# Altium schematic sheet ATMEGA-BOARD.SchDoc
size A4; SheetNumber: 1; SheetTotal: 1
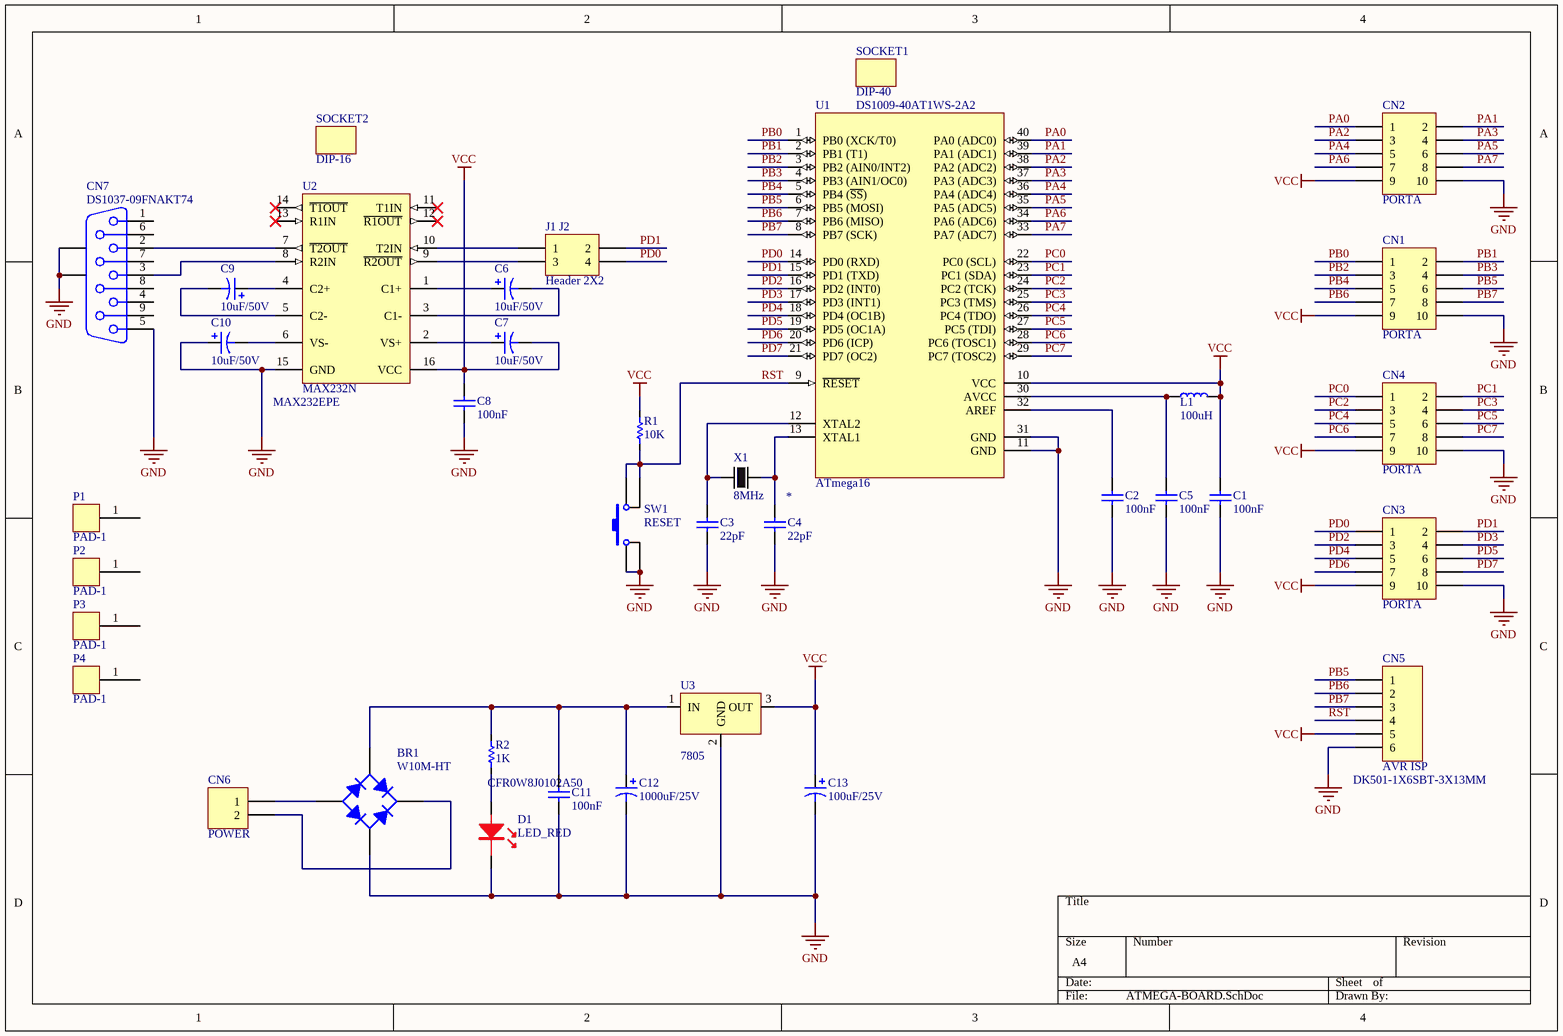
[diagram p0: ATMEGA-BOARD.SchDoc]

## Parts
BR1  W10M-HT  [DIODE-WOB]
C1  100nF  [CAP0.2N]
C2  100nF  [CAP0.2N]
C3  22pF  [CAP0.2N]
C4  22pF  [CAP0.2N]
C5  100nF  [CAP0.2N]
C6  10uF/50V  [CAP_ALUM_5x11x2.5_V]
C7  10uF/50V  [CAP_ALUM_5x11x2.5_V]
C8  100nF  [CAP0.2N]
C9  10uF/50V  [CAP_ALUM_5x11x2.5_V]
C10  10uF/50V  [CAP_ALUM_5x11x2.5_V]
C11  100nF  [CAP0.2N]
C12  1000uF/25V  [CAP_ALUM_10x17x5_V]
C13  100uF/25V  [CAP_ALUM_6.3x11.2x2.5_V]
CN1  PORTA  [CON-DS1013-10SSIB1]
CN2  PORTA  [CON-DS1013-10SSIB1]
CN3  PORTA  [CON-DS1013-10SSIB1]
CN4  PORTA  [CON-DS1013-10SSIB1]
CN5  AVR ISP  Ozdisan Kodu: DK501-1X6SBT-3X13MM  [Pin Header S/M 06x1 TH Pitch 2.54mm]
CN6  POWER  [Klemens-DG126-5.0-02P-14-00AH]
CN7  DS1037-09FNAKT74  [CON-DB9FLW]
D1  LED_RED  [LED3M-RED]
J1_J2  Header 2X2  [Pin Header S/M 02x2 TH Pitch 2.54mm]
L1  100uH  [IND-AL0412]
P1  PAD-1  [DOUBLE-3]  (no BOM)
P2  PAD-1  [DOUBLE-3]  (no BOM)
P3  PAD-1  [DOUBLE-3]  (no BOM)
P4  PAD-1  [DOUBLE-3]  (no BOM)
R1  10K  [RES_AXIAL-0.3]
R2  1K  Ozdisan Kodu: CFR0W8J0102A50  [RES_AXIAL-0.3]
SOCKET1  DIP-40  Ozdisan Kodu: DS1009-40AT1WS-2A2  (mechanical)
SOCKET2  DIP-16  (mechanical)
SW1  RESET  [Switch-6x6x4.3]
U1  ATmega16  [DIP40N]
U2  MAX232N  Ozdisan Kodu: MAX232EPE  [DIP16N]
U3  7805  [TO-220_3-H]
X1  8MHz  [XTAL_DIP]

## Nets
GND: BR1.2(C) C1.1 C2.1 C3.1 C4.1 C5.1 C8.1 C10.1 C11.1 C12.2 C13.2 CN1.10 CN2.10 CN3.10 CN4.10 CN5.6 CN7.5 CN7.BO1(MH2) CN7.BO2(MH1) D1.2(K) SW1.1 U1.11(GND) U1.31(GND) U2.15(GND) U3.2(GND)
VCC: C1.2 C7.2 C8.2 C13.1 CN1.9 CN2.9 CN3.9 CN4.9 CN5.5 L1.2 R1.2 U1.10(VCC) U2.16(VCC) U3.3(OUT)
PA0: CN2.1 U1.40(PA0_(ADC0))
PA1: CN2.2 U1.39(PA1_(ADC1))
PA2: CN2.3 U1.38(PA2_(ADC2))
PA3: CN2.4 U1.37(PA3_(ADC3))
PA4: CN2.5 U1.36(PA4_(ADC4))
PA5: CN2.6 U1.35(PA5_(ADC5))
PA6: CN2.7 U1.34(PA6_(ADC6))
PA7: CN2.8 U1.33(PA7_(ADC7))
PB0: CN1.1 U1.1(PB0_(XCK/T0))
PB1: CN1.2 U1.2(PB1_(T1))
PB2: CN1.3 U1.3(PB2_(AIN0/INT2))
PB3: CN1.4 U1.4(PB3_(AIN1/OC0))
PB4: CN1.5 U1.5(PB4_(~{SS}))
PB5: CN1.6 CN5.1 U1.6(PB5_(MOSI))
PB6: CN1.7 CN5.2 U1.7(PB6_(MISO))
PB7: CN1.8 CN5.3 U1.8(PB7_(SCK))
PC0: CN4.1 U1.22(PC0_(SCL))
PC1: CN4.2 U1.23(PC1_(SDA))
PC2: CN4.3 U1.24(PC2_(TCK))
PC3: CN4.4 U1.25(PC3_(TMS))
PC4: CN4.5 U1.26(PC4_(TDO))
PC5: CN4.6 U1.27(PC5_(TDI))
PC6: CN4.7 U1.28(PC6_(TOSC1))
PC7: CN4.8 U1.29(PC7_(TOSC2))
PD0: CN3.1 J1_J2.4 U1.14(PD0_(RXD))
PD1: CN3.2 J1_J2.2 U1.15(PD1_(TXD))
PD2: CN3.3 U1.16(PD2_(INT0))
PD3: CN3.4 U1.17(PD3_(INT1))
PD4: CN3.5 U1.18(PD4_(OC1B))
PD5: CN3.6 U1.19(PD5_(OC1A))
PD6: CN3.7 U1.20(PD6_(ICP))
PD7: CN3.8 U1.21(PD7_(OC2))
RST: CN5.4 R1.1 SW1.2 U1.9(~{RESET})
NetBR1_1: BR1.1(K) CN6.2
NetBR1_3: BR1.3(A) CN6.1
NetBR1_4: BR1.4(C) C11.2 C12.1 R2.2 U3.1(IN)
NetC2_2: C2.2 U1.32(AREF)
NetC3_2: C3.2 U1.12(XTAL2) X1.2
NetC4_2: C4.2 U1.13(XTAL1) X1.1
NetC5_2: C5.2 L1.1 U1.30(AVCC)
NetC6_1: C6.1 U2.1(C1+)
NetC6_2: C6.2 U2.3(C1-)
NetC7_1: C7.1 U2.2(VS+)
NetC9_1: C9.1 U2.4(C2+)
NetC9_2: C9.2 U2.5(C2-)
NetC10_2: C10.2 U2.6(VS-)
NetCN7_2: CN7.2 U2.7(~{T2OUT})
NetCN7_3: CN7.3 U2.8(R2IN)
NetD1_1: D1.1(A) R2.1
NetJ1_J2_1: J1_J2.1 U2.10(T2IN)
NetJ1_J2_3: J1_J2.3 U2.9(~{R2OUT})

Not connected (* = marked no-connect by the designer): CN7 1 4 6 7 8 9; P1 1; P2 1; P3 1; P4 1; U2 11(T1IN)* 12(~{R1OUT})* 13(R1IN)* 14(~{T1OUT})*

## Library data of the parts
BR1 = Bridge1: Full Wave Diode Bridge; Ozdisan Kodu: W10M-HT
C1 C2 C5 C8 C11 = Cap: Capacitor; Ozdisan Kodu: MKT0805B104K101PF3R
C3 C4 = Cap: Capacitor; Ozdisan Kodu: MKT0805N220J500PF3R
C6 C7 C9 C10 = Cap Pol3: Polarized Capacitor; Ozdisan Kodu: PKR1-050V100MC110-T2.5
C12 = Cap Pol3: Polarized Capacitor; Ozdisan Kodu: PKLH-025V102MG170-T/A5.07
C13 = Cap Pol3: Polarized Capacitor; Ozdisan Kodu: PKR1-025V101ME110-T/A5.0
CN1-CN4 = Header 5X2H: Header, 5-Pin, Dual row, Right Angle; Ozdisan Kodu: DS1013-10SSIB1
CN5 = Header 6: Header, 6-Pin
CN6 = Header 2: Header, 2-Pin; Ozdisan Kodu: DG126-5.0-02P-14-00AH
CN7 = D Connector 9: CONNECTOR DSUB 9PIN 90C PCB TYPE FEMALE; Ozdisan Kodu: DS1037-09FNAKT74
D1 = LED_RED: Ozdisan Kodu: 3R4UD-8
J1_J2 = Header 2X2: Header, 2-Pin, Dual row; Ozdisan Kodu: L-KLS1-207-2-04-S
L1 = Inductor: Ozdisan Kodu: AL0412-101K-LF
R1 = R: Resistor; Ozdisan Kodu: CFR0W4J0103A50
R2 = R: Resistor
SOCKET1 = MECHANIC
SOCKET2 = MECHANIC: Ozdisan Kodu: DS1009-16AT1NX-2A2
SW1 = SW-PB: Switch; Ozdisan Kodu: DTS-61R-V
U1 = CMP-0095-00359-1: 8-bit AVR Microcontroller, 4.5-5.5V; Ozdisan Kodu: *
U2 = CMP-0299-00084-2: Dual EIA-232 Driver / Receiver, 0 to 70 degC, 16-Pin PDIP (N), Pb-Free (RoHS)
U3 = 78M05: IC REG LINEAR 5V 500MA DPAK; Ozdisan Kodu: L7805CV-DG
X1 = XTAL: Ozdisan Kodu: AS-8.000-20-H35; ComponentLink1URL: \\vikoonline\TPM-ARGE\AR-GE\DATA SHEET\